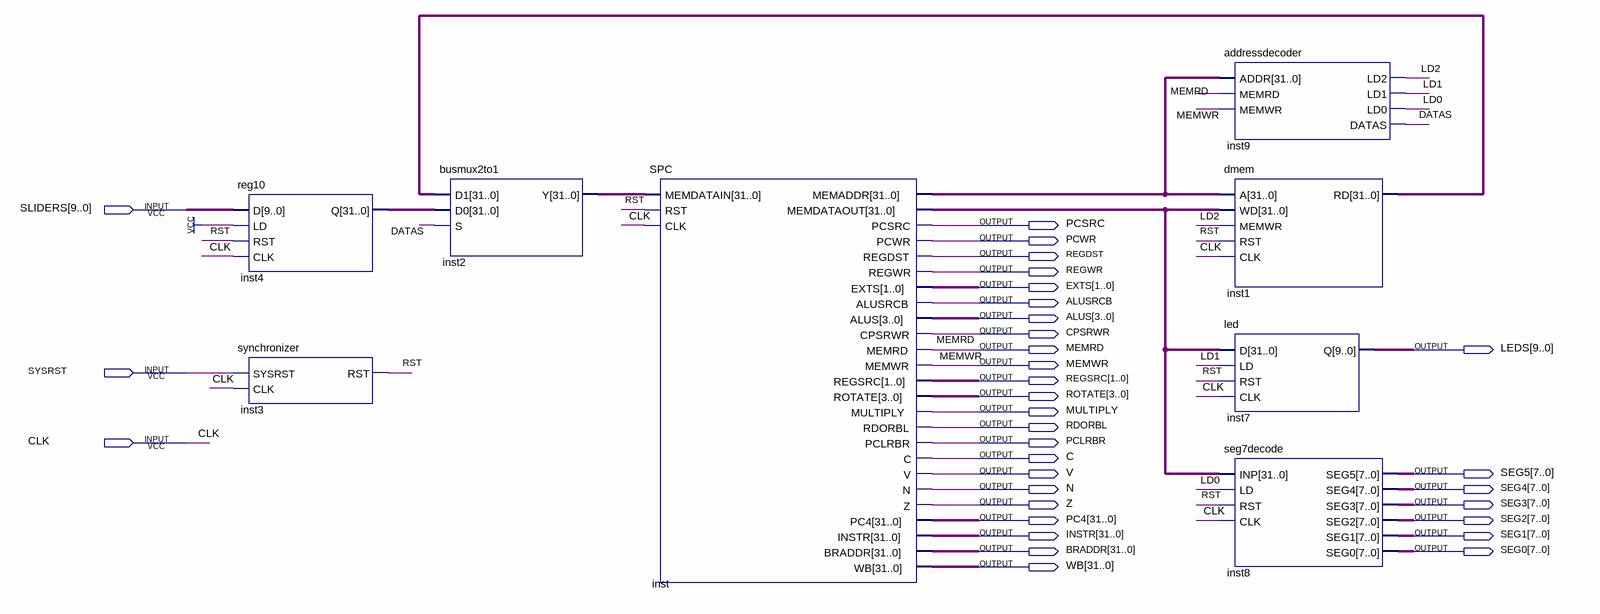
[diagram p0: schematic sheet]
// Quartus schematic fpga.bdf as structural Verilog: 8 symbols, 33 pins
module fpga (
  input  [9:0] SLIDERS,
  input  SYSRST,
  input  CLK,
  output PCSRC,
  output PCWR,
  output REGDST,
  output REGWR,
  output [1:0] EXTS,
  output ALUSRCB,
  output [3:0] ALUS,
  output CPSRWR,
  output MEMRD,
  output [9:0] LEDS,
  output MEMWR,
  output [1:0] REGSRC,
  output [3:0] ROTATE,
  output MULTIPLY,
  output RDORBL,
  output PCLRBR,
  output C,
  output V,
  output [7:0] SEG5,
  output N,
  output [7:0] SEG4,
  output Z,
  output [7:0] SEG3,
  output [31:0] PC4,
  output [7:0] SEG2,
  output [31:0] INSTR,
  output [7:0] SEG1,
  output [31:0] BRADDR,
  output [7:0] SEG0,
  output [31:0] WB
);

  wire DATAS, LD0, LD1, LD2, RST;
  wire [31:0] inst1_rd, inst2_y, inst4_q, inst_memaddr, inst_memdataout;

  reg10 inst4 (.D(SLIDERS), .LD(1'b1), .RST(RST), .CLK(CLK), .Q(inst4_q));
  synchronizer inst3 (.SYSRST(SYSRST), .CLK(CLK), .RST(RST));
  busmux2to1 inst2 (.D1(inst1_rd), .D0(inst4_q), .S(DATAS), .Y(inst2_y));
  SPC inst (
    .MEMDATAIN(inst2_y), .RST(RST), .CLK(CLK), .MEMADDR(inst_memaddr), .MEMDATAOUT(inst_memdataout),
    .PCSRC(PCSRC), .PCWR(PCWR), .REGDST(REGDST), .REGWR(REGWR), .EXTS(EXTS), .ALUSRCB(ALUSRCB), .ALUS(ALUS),
    .CPSRWR(CPSRWR), .MEMRD(MEMRD), .MEMWR(MEMWR), .REGSRC(REGSRC), .ROTATE(ROTATE), .MULTIPLY(MULTIPLY),
    .RDORBL(RDORBL), .PCLRBR(PCLRBR), .C(C), .V(V), .N(N), .Z(Z), .PC4(PC4), .INSTR(INSTR), .BRADDR(BRADDR),
    .WB(WB));
  addressdecoder inst9 (
    .ADDR(inst_memaddr), .MEMRD(MEMRD), .MEMWR(MEMWR), .LD2(LD2), .LD1(LD1), .LD0(LD0), .DATAS(DATAS));
  dmem inst1 (.A(inst_memaddr), .WD(inst_memdataout), .MEMWR(LD2), .RST(RST), .CLK(CLK), .RD(inst1_rd));
  led inst7 (.D(inst_memdataout), .LD(LD1), .RST(RST), .CLK(CLK), .Q(LEDS));
  seg7decode inst8 (
    .INP(inst_memdataout), .LD(LD0), .RST(RST), .CLK(CLK), .SEG5(SEG5), .SEG4(SEG4), .SEG3(SEG3),
    .SEG2(SEG2), .SEG1(SEG1), .SEG0(SEG0));
endmodule
